# Altium schematic sheet Microcontroller.SchDoc
size A3; SheetNumber: 4; SheetTotal: 5
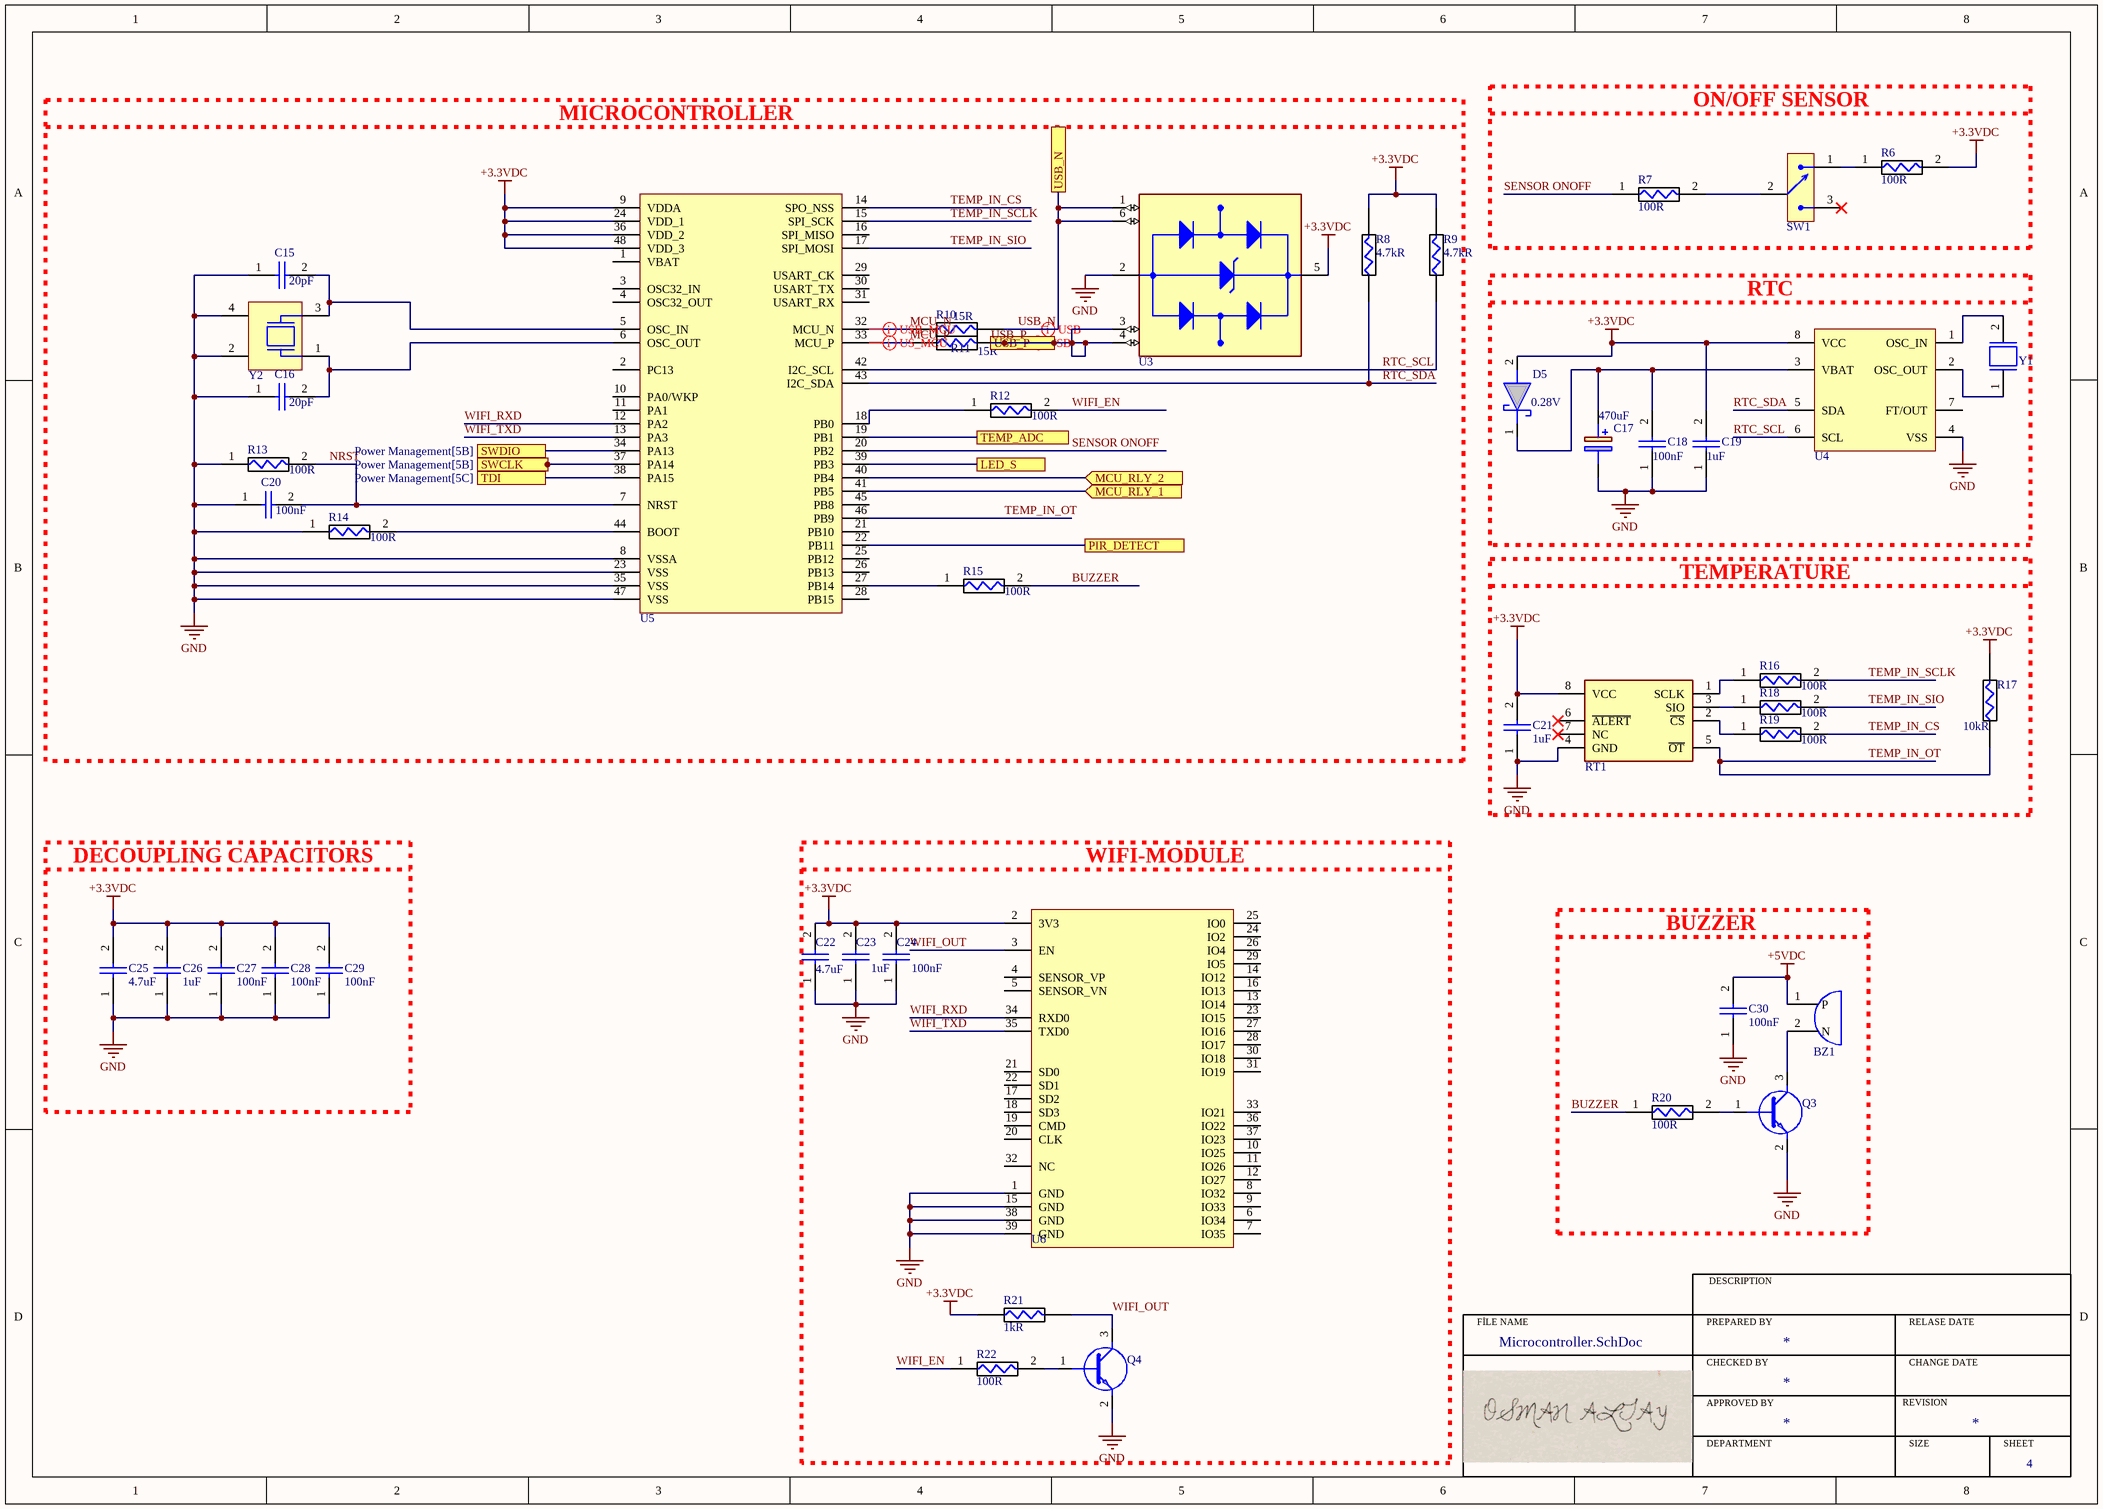
[diagram p0: Microcontroller.SchDoc]

## Parts
BZ1  CMI-9605IC-0580T  [CMI-9605IC-0580T]  (value not drawn)
C15  value 20pF  [CAP_0603]  (hidden comment: CL10C200JB8NNNC)
C16  value 20pF  [CAP_0603]  (hidden comment: CL10C200JB8NNNC)
C17  value 470uF  [ESH477M050AH4AA]  (hidden comment: ESH477M050AH4AA)
C18  value 100nF  [CAP_0805]  (hidden comment: CL21B104KBCNNNC)
C19  value 1uF  [CAP_0805]  (hidden comment: CL21B105KBFNNNE)
C20  value 100nF  [CAP_0603]  (hidden comment: C0603C104K1RACTU)
C21  value 1uF  [CAP_0805]  (hidden comment: CL21B105KBFNNNE)
C22  value 4.7uF  [CAP_0805]  (hidden comment: CL21A475KAQNNNE)
C23  value 1uF  [CAP_0805]  (hidden comment: CL21B105KBFNNNE)
C24  value 100nF  [CAP_0603]  (hidden comment: C0603C104K1RACTU)
C25  value 4.7uF  [CAP_0805]  (hidden comment: CL21A475KAQNNNE)
C26  value 1uF  [CAP_0805]  (hidden comment: CL21B105KBFNNNE)
C27  value 100nF  [CAP_0603]  (hidden comment: C0603C104K1RACTU)
C28  value 100nF  [CAP_0603]  (hidden comment: C0603C104K1RACTU)
C29  value 100nF  [CAP_0603]  (hidden comment: C0603C104K1RACTU)
C30  value 100nF  [CAP_0805]  (hidden comment: CL21B104KBCNNNC)
D5  Forward Voltage: 0.28V  [SOD882]  (hidden comment: RB521CS30L,315)
Q3  MMBT3904-7-F  [SOT23-3]  (value not drawn)
Q4  MMBT3904-7-F  [SOT23-3]  (value not drawn)
R6  value 100R  [RES_0603]  (hidden comment: RC0603FR-07100RL)
R7  value 100R  [RES_0603]  (hidden comment: RC0603FR-07100RL)
R8  value 4.7kR  [RES_0603]  (hidden comment: RC0603JR-074K7L)
R9  value 4.7kR  [RES_0603]  (hidden comment: RC0603JR-074K7L)
R10  value 15R  [RES_0603]  (hidden comment: RC0603JR-0715RL)
R11  value 15R  [RES_0603]  (hidden comment: RC0603JR-0715RL)
R12  value 100R  [RES_0603]  (hidden comment: RC0603FR-07100RL)
R13  value 100R  [RES_0603]  (hidden comment: RC0603FR-07100RL)
R14  value 100R  [RES_0603]  (hidden comment: RC0603FR-07100RL)
R15  value 100R  [RES_0603]  (hidden comment: RC0603FR-07100RL)
R16  value 100R  [RES_0603]  (hidden comment: RC0603FR-07100RL)
R17  value 10kR  [RES_0603]  (hidden comment: RC0603FR-0710KL)
R18  value 100R  [RES_0603]  (hidden comment: RC0603FR-07100RL)
R19  value 100R  [RES_0603]  (hidden comment: RC0603FR-07100RL)
R20  value 100R  [RES_0603]  (hidden comment: RC0603FR-07100RL)
R21  value 1kR  [RES_0603]  (hidden comment: RC0201JR-071KL)
R22  value 100R  [RES_0603]  (hidden comment: RC0603FR-07100RL)
RT1  MAX6662MSA+  [MAX6662MSA+]  (value not drawn)
SW1  EG1215AA  [SW_EG1215AA]  (value not drawn)
U3  USBLC6-2SC6  [SOT23-6]  (value not drawn)
U4  M41T00M6F  [M41T00]  (value not drawn)
U5  STM32F103C6T6A  [LQFP-48]  (value not drawn)
U6  ESP32-WROOM-32  [ESP32]  (value not drawn)
Y1  ABS05-32.768KHZ-T  [ABS05]  (value not drawn)
Y2  ECS-160-20-30B-TR  [ECS]  (value not drawn)

## Blocks framed on the sheet
MICROCONTROLLER: C15 C16 C20 R8-R15 U3 U5 Y2
ON/OFF SENSOR: R6 R7 SW1
TEMPERATURE: C21 R16-R19 RT1
DECOUPLING CAPACITORS: C25-C29
WIFI-MODULE: C22-C24 Q4 R21 R22 U6
BUZZER: BZ1 C30 Q3 R20

## Ports
LED_S (see Power Management[3C]), MCU_RLY_1 (in, see Power Management[4A]), MCU_RLY_2 (in, see Power Management[6A]), PIR_DETECT (see Power Management[3C]), SWCLK (see Power Management[5B]), SWDIO (see Power Management[5B]), TDI (see Power Management[5C]), TEMP_ADC (see Power Management[3C]), USB_N (see Power Management[8B]), USB_P (see Power Management[8B])

## Nets
+3.3VDC: C19.2 C21.2 C22.2 C23.2 C24.2 C25.2 C26.2 C27.2 C28.2 C29.2 D5.2(A) R6.2 R8.2 R9.2 R17.2 R21.1 RT1.8(VCC) U3.5(VBUS) U4.8(VCC) U5.9(VDDA) U5.24(VDD_1) U5.36(VDD_2) U5.48(VDD_3) U6.2(3V3)
+5VDC: BZ1.1(P) C30.2
GND: C15.1 C16.1 C17.2(-) C18.1 C19.1 C20.1 C21.1 C22.1 C23.1 C24.1 C25.1 C26.1 C27.1 C28.1 C29.1 C30.1 Q3.2(E) Q4.2(E) R13.1 R14.1 RT1.4(GND) U3.2(GND) U4.4(VSS) U5.8(VSSA) U5.23(VSS) U5.35(VSS) U5.47(VSS) U6.1(GND) U6.15(GND) U6.38(GND) U6.39(GND) Y2.2(GND) Y2.4(GND)
BUZZER: R15.2 R20.1
LED_S: U5.39(PB3) ; port LED_S
MCU_N: R10.1 U5.32(MCU_N)
MCU_P: R11.1 U5.33(MCU_P)
MCU_RLY_1: U5.41(PB5) ; port MCU_RLY_1
MCU_RLY_2: U5.40(PB4) ; port MCU_RLY_2
NRST: C20.2 R13.2 U5.7(NRST)
PIR_DETECT: U5.22(PB11) ; port PIR_DETECT
RTC_SCL: R9.1 U4.6(SCL) U5.42(I2C_SCL)
RTC_SDA: R8.1 U4.5(SDA) U5.43(I2C_SDA)
SENSOR ONOFF: R7.1 U5.20(PB2)
SWCLK: U5.37(PA14) ; port SWCLK
SWDIO: U5.34(PA13) ; port SWDIO
TDI: U5.38(PA15) ; port TDI
TEMP_ADC: U5.19(PB1) ; port TEMP_ADC
TEMP_IN_CS: R19.2 U5.14(SPO_NSS)
TEMP_IN_OT: R17.1 RT1.5(~{OT}) U5.46(PB9)
TEMP_IN_SCLK: R16.2 U5.15(SPI_SCK)
TEMP_IN_SIO: R18.2 U5.17(SPI_MOSI)
USB_N: R10.2 U3.1(I/O1_IN) U3.6(I/O1_OUT) ; port USB_N
USB_P: R11.2 U3.3(I/O2_IN) U3.4(I/O2_OUT) ; port USB_P
WIFI_EN: R12.2 R22.1
WIFI_OUT: Q4.3(C) R21.2 U6.3(EN)
WIFI_RXD: U5.12(PA2) U6.34(RXD0)
WIFI_TXD: U5.13(PA3) U6.35(TXD0)
NetBZ1_2: BZ1.2(N) Q3.3(C)
NetC15_2: C15.2 U5.5(OSC_IN) Y2.3(OUT/IN)
NetC16_2: C16.2 U5.6(OSC_OUT) Y2.1(IN/OUT)
NetC17_1: C17.1(+) C18.2 D5.1(K) U4.3(VBAT)
NetQ3_1: Q3.1(B) R20.2
NetQ4_1: Q4.1(B) R22.2
NetR6_1: R6.1 SW1.1
NetR7_2: R7.2 SW1.2
NetR12_1: R12.1 U5.18(PB0)
NetR14_2: R14.2 U5.44(BOOT)
NetR15_1: R15.1 U5.27(PB14)
NetR16_1: R16.1 RT1.1(SCLK)
NetR18_1: R18.1 RT1.3(SIO)
NetR19_1: R19.1 RT1.2(~{CS})
NetU4_1: U4.1(OSC_IN) Y1.2
NetU4_2: U4.2(OSC_OUT) Y1.1

Not connected (* = marked no-connect by the designer): RT1 6(~{ALERT})* 7(NC)*; SW1 3*; U4 7(FT/OUT); U5 1(VBAT) 2(PC13) 3(OSC32_IN) 4(OSC32_OUT) 10(PA0/WKP) 11(PA1) 16(SPI_MISO) 21(PB10) 25(PB12) 26(PB13) 28(PB15) 29(USART_CK) 30(USART_TX) 31(USART_RX) 45(PB8); U6 4(SENSOR_VP) 5(SENSOR_VN) 6(IO34) 7(IO35) 8(IO32) 9(IO33) 10(IO25) 11(IO26) 12(IO27) 13(IO14) 14(IO12) 16(IO13) 17(SD2) 18(SD3) 19(CMD) 20(CLK) 21(SD0) 22(SD1) 23(IO15) 24(IO2) 25(IO0) 26(IO4) 27(IO16) 28(IO17) 29(IO5) 30(IO18) 31(IO19) 32(NC) 33(IO21) 36(IO22) 37(IO23)

## Layout directives
differential pair: MCU_N, MCU_P, USB_N, USB_P

## Notes on the sheet
- RTC
- FİLE NAME
- PREPARED BY
- DESCRIPTION
- RELASE DATE
- CHECKED BY
- APPROVED BY
- CHANGE DATE
- DEPARTMENT
- SIZE
- REVISION
- SHEET

## Library data of the parts
BZ1 = CMI-9605IC-0580T: Audio Buzzer Magnetic 3VDC 7VDC 30mA 5VDC 85dB 2600Hz to 2800Hz Through Hole Pin Box; Manufacturer: CUI Devices; Supplier: Mouser; Supplier Part Number: 490-CMI-9605IC-0580T; Manufacturer Part Number: CMI-9605IC-0580T; RoHS: No; Category: Audio Products; Stock: 1177; Pricing: 1=1,42, 10=1,19, 50=1,04, 100=0,975, 1000=0,838, 10000=0,768 (USD)
C15 C16 = CAP CER 20pF 0603: CAP CER 20pF %5 0603; Manufacturer: Samsung; Voltage Rating (DC): 50V; Designed By: Osman; Supplier: Farnell; Supplier Part Number: 3013444RL; Manufacturer Part Number: CL10C200JB8NNNC; RoHS: Yes; Category: Ceramic Capacitors; Stock: 220; Pricing: 500=0,013, 1000=0,011, 2000=0,0108 (EUR); ComponentLink1URL: https://datasheet.ciiva.com/26877/getdatasheetpartid-640634-26877974.pdf?src-supplier=Verical; ComponentLink1Description: https://datasheet.ciiva.com/26877/getdatasheetpartid-640634-26877974.pdf?src-supplier=Verical; ComponentLink2URL: https://datasheet.ciiva.com/26310/mlcc-catalogdownload2013-eng-26310315.pdf?src-supplier=Distrelec; ComponentLink2Description: https://datasheet.ciiva.com/26310/mlcc-catalogdownload2013-eng-26310315.pdf?src-supplier=Distrelec
C17 = CAP ALU 470uF: Cap, 470UF, 50V, Alu Elec, Radial; Manufacturer: KEMET; Designed By: Osman; Supplier: Mouser; Supplier Part Number: 80-ESH477M050AH4AA; Manufacturer Part Number: ESH477M050AH4AA; RoHS: Yes; Stock: 9408; Pricing: 1=0,57, 10=0,338, 50=0,338, 100=0,222, 1000=0,167, 10000=0,148 (USD); ComponentLink1URL: https://api.kemet.com/component-edge/download/datasheet/ESH477M050AH4AA.pdf?src-supplier=Digi-Key; ComponentLink1Description: https://api.kemet.com/component-edge/download/datasheet/ESH477M050AH4AA.pdf?src-supplier=Digi-Key; ComponentLink2URL: https://datasheet.octopart.com/ESH477M050AH4AA-KEMET-datasheet-130075338.pdf?src-supplier=Newark; ComponentLink2Description: https://datasheet.octopart.com/ESH477M050AH4AA-KEMET-datasheet-130075338.pdf?src-supplier=Newark
C18 C30 = CAP CER 100nF 0805: Manufacturer: Samsung; Material: Ceramic; Tolerance: 10%; Dielectric: X7R; Voltage Rating: 50V; Designed By: OSMAN; Supplier: Mouser; Supplier Part Number: 187-CL21B104KBCNNNC; Manufacturer Part Number: CL21B104KBCNNNC; RoHS: Yes; Category: Ceramic Capacitors; Stock: 995893; Pricing: 1=0,1, 10=0,024, 50=0,024, 100=0,014, 1000=0,012, 10000=0,008 (USD); Mounting Technology: Surface Mount; Case/Package: 0805; Case Code (Metric): 2012; Case Code (Imperial): 0805; Min Operating Temperature: -55°C; Max Operating Temperature: 125°C; Packaging: Tape and Reel; Voltage: 50V; Series: CL; Construction: Flat; Voltage Rating (DC): 50V; Length: 2mm; Width: 0.049inch; Height: 0.85mm; Depth: 1.25mm; Thickness: 0.037inch; Radiation Hardening: No; RoHS Compliant: Yes; Lead Free: 5697LeadFree; ComponentLink1URL: https://datasheet.ciiva.com/25710/cl21b104kbcnnnc-25710182.pdf?src-supplier=Digi-Key; ComponentLink1Description: https://datasheet.ciiva.com/25710/cl21b104kbcnnnc-25710182.pdf?src-supplier=Digi-Key; ComponentLink2URL: https://datasheet.ciiva.com/29199/454152-da-01-en-vs-kondensator-0805-29199814.pdf?src-supplier=Conrad; ComponentLink2Description: https://datasheet.ciiva.com/29199/454152-da-01-en-vs-kondensator-0805-29199814.pdf?src-supplier=Conrad
C19 C21 C23 C26 = CAP CER 1uF 0805: CAP CER 1uF %10 0805; Manufacturer: Samsung; Material: Ceramic; Tolerance: 10%; Voltage Rating: 50V; Dielectric: X7R; Designed By: Osman; Supplier: Mouser; Supplier Part Number: 187-CL21B105KBFNNNE; Manufacturer Part Number: CL21B105KBFNNNE; RoHS: Yes; Category: Ceramic Capacitors; Stock: 126210; Pricing: 1=0,11, 10=0,045, 50=0,045, 100=0,027, 1000=0,026, 10000=0,015 (USD); Mounting Technology: Surface Mount; Case/Package: 0805; Case Code (Metric): 2012; Case Code (Imperial): 0805; Min Operating Temperature: -55°C; Max Operating Temperature: 125°C; Packaging: Tape and Reel; Package Quantity: 1; Voltage: 50V; Series: CL; Construction: Flat; Voltage Rating (DC): 50V; Length: 2mm; Width: 0.049inch; Height: 1.25mm; Thickness: 0.053inch; Depth: 1.25mm; Radiation Hardening: No; RoHS Compliant: Yes; ComponentLink1URL: https://datasheet.ciiva.com/25800/cl21b105kbfnnne-25800291.pdf?src-supplier=Digi-Key; ComponentLink1Description: https://datasheet.ciiva.com/25800/cl21b105kbfnnne-25800291.pdf?src-supplier=Digi-Key
C20 C24 C27-C29 = CAP CER 100nf 0603: Capacitor, 0.1UF, 100V, MLCC, 0603;; Manufacturer: KEMET; Designed By: Osman; Supplier: Digi-Key; Supplier Part Number: 399-C0603C104K1RACTUCT-ND; Manufacturer Part Number: C0603C104K1RACTU; RoHS: No; Category: Ceramic Capacitors; Stock: 5862; Pricing: 1=0,27, 10=0,185, 50=0,1232, 100=0,1048, 500=0,07396, 1000=0,06471 (USD)
C22 C25 = CAP CER 4.7uF 0805: CAP CER 4.7uF %10 0805; Manufacturer: Samsung; Material: Ceramic; Tolerance: 10%; Voltage Rating: 25V; Dielectric: X5R; Supplier Part Number: 187-CL21A475KAQNNNE; Manufacturer Part Number: CL21A475KAQNNNE; RoHS: Yes; Category: Ceramic Capacitors; Stock: 195468; Pricing: 1=0,1, 10=0,059, 50=0,059, 100=0,035, 1000=0,025, 10000=0,012 (USD); Mounting Technology: Surface Mount; Case/Package: 0805; Case Code (Metric): 2012; Case Code (Imperial): 0805; Min Operating Temperature: -55°C; Max Operating Temperature: 85°C; Packaging: Tape and Reel; Voltage Rating (DC): 25V; Series: CL; Construction: Flat; Length: 2mm; Height: 1.25mm; Depth: 1.25mm; Radiation Hardening: No; Lead Free: Lead Free; RoHS Compliant: Yes; ComponentLink1URL: https://datasheet.ciiva.com/25798/cl21a475kaqnnne-25798882.pdf?src-supplier=Digi-Key; ComponentLink1Description: https://datasheet.ciiva.com/25798/cl21a475kaqnnne-25798882.pdf?src-supplier=Digi-Key; Supplier: Mouser
D5 = RB521CS30L,315: 100MA Low Vf Mega Schottky Barri; Manufacturer: Nexperia; Manufacturer Part Number: RB521CS30L315; Supplier: Mouser; Supplier Part Number: 771-RB521CS30L315; RoHS: No; Category: Rectifier Diodes; Stock: 268555; Pricing: 1=0,23, 10=0,167, 50=0,167, 100=0,098, 1000=0,049, 10000=0,032 (USD); ComponentLink1URL: https://datasheet.octopart.com/RB521CS30L%2C315-Nexperia-datasheet-87845498.pdf?src-supplier=Future+Electronics; ComponentLink1Description: https://datasheet.octopart.com/RB521CS30L%2C315-Nexperia-datasheet-87845498.pdf?src-supplier=Future+Electronics
Q3 Q4 = MMBT3904-7-F: Transistor General Purpose BJT NPN 40 Volt 0.2A Automotive 3-Pin SOT-23; Manufacturer: Diodes Zetex; Designed By: Osman; Max Power Dissipation: 300mW; Collector Emitter Voltage (VCEO): 40V; Max Collector Current: 200mA; Collector Base Voltage (VCBO): 60V; Power Dissipation: 350mW; Frequency: 300MHz; hFE Min: 100; Number of Elements: 1; Emitter Base Voltage (VEBO): 6V; Collector Emitter Saturation Voltage: 300mV; Supplier: Mouser; Supplier Part Number: 621-MMBT3904-F; Manufacturer Part Number: MMBT3904-7-F; RoHS: Yes; Category: BJTs; Stock: 3104650; Pricing: 1=0,11, 10=0,076, 50=0,076, 100=0,048, 1000=0,021, 10000=0,014 (USD); Mounting Technology: Surface Mount; Case/Package: SOT-23; Pins: 3; Weight: 0.000282oz; Min Operating Temperature: -55°C; Max Operating Temperature: 150°C; Polarity: NPN; Packaging: Tape and Reel; Package Quantity: 3000; Transition Frequency: 300MHz; Collector Emitter Breakdown Voltage: 40V; Max Breakdown Voltage: 40V; Continuous Collector Current: 200mA; Clock Frequency: 300MHz; Gain Bandwidth Product: 300MHz; Voltage Rating (DC): 40V; Series: Automotive, AEC-Q101; Collector-emitter Voltage-Max: 300mV; Length: 3.05mm; Width: 1.4mm; Height: 1mm; Radiation Hardening: No; Reach SVHC Compliant: No; Lead Free: Lead Free; RoHS Compliant: Yes; ComponentLink1URL: https://datasheet.ciiva.com/11201/ds30036-11201778.pdf?src-supplier=Avnet; ComponentLink1Description: https://datasheet.ciiva.com/11201/ds30036-11201778.pdf?src-supplier=Avnet; ComponentLink2URL: https://datasheet.ciiva.com/15138/getdatasheetpartid-53265-15138780.pdf?src-supplier=Verical; ComponentLink2Description: https://datasheet.ciiva.com/15138/getdatasheetpartid-53265-15138780.pdf?src-supplier=Verical; ComponentLink3URL: https://datasheet.ciiva.com/22711/1915516-22711750.pdf?src-supplier=Element14; ComponentLink3Description: https://datasheet.ciiva.com/22711/1915516-22711750.pdf?src-supplier=Element14; ComponentLink4URL: https://datasheet.ciiva.com/11198/ds30036-11198999.pdf?src-supplier=Avnet; ComponentLink4Description: https://datasheet.ciiva.com/11198/ds30036-11198999.pdf?src-supplier=Avnet; ComponentLink5URL: https://datasheet.ciiva.com/6361/ds30036-6361256.pdf?src-supplier=Digi-Key; ComponentLink5Description: https://datasheet.ciiva.com/6361/ds30036-6361256.pdf?src-supplier=Digi-Key; ComponentLink6URL: https://datasheet.ciiva.com/6361/ds30036-6361254.pdf?src-supplier=Digi-Key; ComponentLink6Description: https://datasheet.ciiva.com/6361/ds30036-6361254.pdf?src-supplier=Digi-Key
R6 R7 R12-R16 R18-R20 R22 = RES 100 OHM 0603: SMD Chip Resistor, 100 Ohm, ± 1%, 100 mW, 0603 [1608 Metric], Thick Film, General Purpose; Manufacturer: Yageo; Temperature Coefficient: 100ppm/°C; Voltage Rating (DC): 50V; Power Rating: 100mW; Supplier: Digi-Key; Supplier Part Number: 311-100HRTR-ND; Manufacturer Part Number: RC0603FR-07100RL; RoHS: Yes; Category: Chip SMD Resistors; Stock: 2448697; Pricing: 5000=0,00382, 10000=0,00335, 25000=0,00287, 35000=0,00278, 50000=0,00257, 125000=0,00232 (USD); Case/Package: 0603; Pins: 2; Case Code (Imperial): 0603; Case Code (Metric): 1608; Min Operating Temperature: -55°C; Max Operating Temperature: 155°C; Tolerance: 1%; Resistor Type: Thick Film; Packaging: Tape and Reel; Voltage Rating: 50V; Termination: SMD/SMT; Features: Moisture Resistant; Series: RC; Max Power Dissipation: 100mW; Number of Terminations: 2; Construction: Rectangular; Resistance Tolerance: 1%; Technology: THICK FILM; Length: 1.6mm; Width: 0.8mm; Height: 0.45mm; Depth: 0.8mm; Lead Free: Lead Free; RoHS Compliant: Yes; Reach SVHC Compliant: Unknown; Military Standard: Not
R8 R9 = RES 4K7 OHM 0603: SMD Chip Resistor, 4.7 kOhm, ± 5%, 100 mW, 0603 [1608 Metric], Thick Film, General Purpose; Manufacturer: Yageo; Voltage Rating (DC): 50V; Temperature Coefficient: 100ppm/°C; Power Rating: 100mW; Supplier: Mouser; Supplier Part Number: 603-RC0603JR-074K7L; Manufacturer Part Number: RC0603JR-074K7L; RoHS: Yes; Category: Chip SMD Resistors; Stock: 1439844; Pricing: 1=0,1, 10=0,009, 50=0,009, 100=0,005, 1000=0,005, 10000=0,002 (USD); Case/Package: 0603; Pins: 2; Case Code (Imperial): 0603; Case Code (Metric): 1608; Min Operating Temperature: -55°C; Max Operating Temperature: 155°C; Resistor Type: Thick Film; Tolerance: 5%; Packaging: Tape and Reel; Voltage Rating: 50V; Termination: SMD/SMT; Features: Moisture Resistant; Max Power Dissipation: 100mW; Number of Terminations: 2; Series: RC; Resistance Tolerance: 5%; Construction: Rectangular; Voltage Rating (AC): 50V; Length: 1.6mm; Width: 0.8mm; Depth: 0.8mm; Reach SVHC Compliant: No; RoHS Compliant: Yes; Lead Free: 5697LeadFree; Military Standard: Not; ComponentLink1URL: https://datasheet.ciiva.com/46412/443971-46412858.pdf?src-supplier=Element14; ComponentLink1Description: https://datasheet.ciiva.com/46412/443971-46412858.pdf?src-supplier=Element14
R10 R11 = RES 15 OHM 0603: SMD Chip Resistor, 15 Ohm, ± 5%, 100 mW, 0603 [1608 Metric], Thick Film, General Purpose; Manufacturer: Yageo; Voltage Rating (AC): 50V; Supplier: Farnell; Supplier Part Number: 4151593; Manufacturer Part Number: RC0603JR-0715RL; RoHS: Yes; Category: Chip SMD Resistors; Stock: 5000; Pricing: 5000=0,002, 25000=0,0019, 50000=0,0018 (EUR); ComponentLink1URL: https://datasheet.ciiva.com/2453/pyu-r-int-thick-7-2453085.pdf?src-supplier=Digi-Key; ComponentLink1Description: https://datasheet.ciiva.com/2453/pyu-r-int-thick-7-2453085.pdf?src-supplier=Digi-Key; ComponentLink2URL: https://datasheet.ciiva.com/2453/pyu-r-int-thick-7-2453086.pdf?src-supplier=Digi-Key; ComponentLink2Description: https://datasheet.ciiva.com/2453/pyu-r-int-thick-7-2453086.pdf?src-supplier=Digi-Key; ComponentLink3URL: https://datasheet.ciiva.com/2453/pyu-r-int-thick-7-2453087.pdf?src-supplier=Digi-Key; ComponentLink3Description: https://datasheet.ciiva.com/2453/pyu-r-int-thick-7-2453087.pdf?src-supplier=Digi-Key; ComponentLink4URL: https://datasheet.ciiva.com/7746/443971-7746445.pdf?src-supplier=Element14; ComponentLink4Description: https://datasheet.ciiva.com/7746/443971-7746445.pdf?src-supplier=Element14; ComponentLink5URL: https://datasheet.ciiva.com/7746/443971-7746446.pdf?src-supplier=Element14; ComponentLink5Description: https://datasheet.ciiva.com/7746/443971-7746446.pdf?src-supplier=Element14
R17 = RES 10K Ohm 0603: RES 10K OHM %10 0603; Manufacturer: Yageo; Tolerance: 1%; Temperature Coefficient: 100ppm/°C; Voltage Rating (DC): 50V; Power Rating: 100mW; Voltage Rating: 75V; Designed Ny: Osman; Supplier: Digi-Key; Supplier Part Number: 311-10.0KHRDKR-ND; Manufacturer Part Number: RC0603FR-0710KL; RoHS: Yes; Category: Chip SMD Resistors; Stock: 22481256; Pricing: 1=0,1, 10=0,018, 50=0,0106, 100=0,0088, 500=0,00592, 1000=0,00505 (USD); Case/Package: 0603; Pins: 2; Case Code (Imperial): 0603; Case Code (Metric): 1608; Weight: 7.1E-05oz; Min Operating Temperature: -55°C; Max Operating Temperature: 155°C; Resistor Type: Thick Film; Packaging: Tape and Reel; Termination: SMD/SMT; Features: Moisture Resistant; Series: RC; Max Power Dissipation: 100mW; Number of Terminations: 2; Resistance Tolerance: 1%; Construction: Rectangular; Length: 1.6mm; Width: 0.8mm; Height: 0.45mm; Depth: 0.8mm; Lead Pitch: 0.3mm; Reach SVHC Compliant: No; Lead Free: 5697LeadFree; Military Standard: Not; RoHS Compliant: Yes; ComponentLink1URL: https://datasheet.ciiva.com/7660/38590-7660789.pdf?src-supplier=Element14; ComponentLink1Description: https://datasheet.ciiva.com/7660/38590-7660789.pdf?src-supplier=Element14; ComponentLink2URL: https://datasheet.ciiva.com/7983/443971-7983596.pdf?src-supplier=Element14; ComponentLink2Description: https://datasheet.ciiva.com/7983/443971-7983596.pdf?src-supplier=Element14; ComponentLink3URL: https://datasheet.ciiva.com/22747/443971-22747519.pdf?src-supplier=Element14; ComponentLink3Description: https://datasheet.ciiva.com/22747/443971-22747519.pdf?src-supplier=Element14; ComponentLink4URL: https://datasheet.ciiva.com/46440/1868787-46440891.pdf?src-supplier=Element14; ComponentLink4Description: https://datasheet.ciiva.com/46440/1868787-46440891.pdf?src-supplier=Element14; ComponentLink5URL: https://datasheet.ciiva.com/7746/1738695-7746239.pdf?src-supplier=Element14; ComponentLink5Description: https://datasheet.ciiva.com/7746/1738695-7746239.pdf?src-supplier=Element14; ComponentLink6URL: https://datasheet.ciiva.com/15189/getdatasheetpartid-409289-15189591.pdf?src-supplier=Verical; ComponentLink6Description: https://datasheet.ciiva.com/15189/getdatasheetpartid-409289-15189591.pdf?src-supplier=Verical
R21 = RES 1K OHM 0603: Res Thick Film 0201 1K Ohm 5% 0.05W(1/20W) ±200ppm/C Pad SMD T/R; Manufacturer: Yageo; Supplier: Digi-Key; Supplier Part Number: 311-1KNCT-ND; Manufacturer Part Number: RC0201JR-071KL; RoHS: Yes; Category: Chip SMD Resistors; Stock: 16512; Pricing: 1=0,1, 10=0,02, 50=0,0124, 100=0,0104, 500=0,0071, 1000=0,00612, 5000=0,00444 (USD); ComponentLink1URL: https://datasheet.ciiva.com/46391/1421516-46391293.pdf?src-supplier=Element14; ComponentLink1Description: https://datasheet.ciiva.com/46391/1421516-46391293.pdf?src-supplier=Element14; ComponentLink2URL: https://datasheet.ciiva.com/7660/1421516-7660811.pdf?src-supplier=Element14; ComponentLink2Description: https://datasheet.ciiva.com/7660/1421516-7660811.pdf?src-supplier=Element14; ComponentLink3URL: https://datasheet.ciiva.com/7672/1563626-7672264.pdf?src-supplier=Element14; ComponentLink3Description: https://datasheet.ciiva.com/7672/1563626-7672264.pdf?src-supplier=Element14; ComponentLink4URL: https://datasheet.ciiva.com/7672/1563626-7672265.pdf?src-supplier=Element14; ComponentLink4Description: https://datasheet.ciiva.com/7672/1563626-7672265.pdf?src-supplier=Element14; ComponentLink5URL: https://datasheet.ciiva.com/8896/pyu-rc0201-51-rohs-l-8-8896175.pdf?src-supplier=Avnet; ComponentLink5Description: https://datasheet.ciiva.com/8896/pyu-rc0201-51-rohs-l-8-8896175.pdf?src-supplier=Avnet; ComponentLink6URL: https://datasheet.ciiva.com/2462/pyu-r-int-thick-7-2462829.pdf?src-supplier=Digi-Key; ComponentLink6Description: https://datasheet.ciiva.com/2462/pyu-r-int-thick-7-2462829.pdf?src-supplier=Digi-Key; ComponentLink7URL: https://datasheet.ciiva.com/2462/pyu-r-int-thick-7-2462830.pdf?src-supplier=Digi-Key; ComponentLink7Description: https://datasheet.ciiva.com/2462/pyu-r-int-thick-7-2462830.pdf?src-supplier=Digi-Key; ComponentLink8URL: https://datasheet.ciiva.com/2462/pyu-r-int-thick-7-2462831.pdf?src-supplier=Digi-Key; ComponentLink8Description: https://datasheet.ciiva.com/2462/pyu-r-int-thick-7-2462831.pdf?src-supplier=Digi-Key
RT1 = MAX6662MSA+: Temp Sensor Digital Serial (3-Wire, SPI) 8-Pin SOIC N Tube; Manufacturer: Maxim; Designed By: Osman; Supplier: Mouser; Supplier Part Number: 700-MAX6662MSA; Manufacturer Part Number: MAX6662MSA+; RoHS: Yes; Category: Temperature and Humidity Sensors; Stock: 1124; Pricing: 1=4,6, 10=3,45, 50=3,45, 100=2,81, 1000=2,2, 10000=2,12 (USD); ComponentLink1URL: https://datasheet.ciiva.com/5299/max6662-89142-5299456.pdf?src-supplier=Mouser; ComponentLink1Description: https://datasheet.ciiva.com/5299/max6662-89142-5299456.pdf?src-supplier=Mouser; ComponentLink2URL: https://datasheet.ciiva.com/2003/max6662-2003390.pdf?src-supplier=Digi-Key; ComponentLink2Description: https://datasheet.ciiva.com/2003/max6662-2003390.pdf?src-supplier=Digi-Key; ComponentLink3URL: https://datasheet.ciiva.com/3277/max6662-3277979.pdf?src-supplier=Avnet; ComponentLink3Description: https://datasheet.ciiva.com/3277/max6662-3277979.pdf?src-supplier=Avnet
SW1 = EG1215AA: Slide Switch, SPDT, 0.025A, 24V, SMD; Manufacturer: E-Switch; Mechanical Life: 10000Cycles; Switch Function: On-On; Actuator Type: Standard; Switch Travel: 1.5mm; Operating Force: 150gf; Actuator Length: 1.4mm; Desgined By: Osman; Supplier: Digi-Key; Supplier Part Number: EG5720CT-ND; Manufacturer Part Number: EG1215AA; RoHS: Yes; Stock: 17551; Pricing: 1=0,99, 10=0,951, 25=0,8884, 100=0,7715, 250=0,702, 500=0,6508, 1000=0,60327 (USD); Mounting Technology: Surface Mount; Min Operating Temperature: -20°C; Max Operating Temperature: 70°C; Throw Configuration: SPDT; Packaging: Cut Tape; Voltage Rating (DC): 24V; Termination: Gull Wing; Electrical Life: 10000Cycles; Series: EG; RoHS Compliant: Yes; ComponentLink1URL: https://media.digikey.com/pdf/Data%20Sheets/E-Switch%20PDFs/EG1215_Series_Ds.pdf?src-supplier=Digi-Key; ComponentLink1Description: https://media.digikey.com/pdf/Data%20Sheets/E-Switch%20PDFs/EG1215_Series_Ds.pdf?src-supplier=Digi-Key; ComponentLink2URL: http://www.farnell.com/datasheets/2645007.pdf?src-supplier=Farnell; ComponentLink2Description: http://www.farnell.com/datasheets/2645007.pdf?src-supplier=Farnell
U3 = USBLC6-2SC6: USBLC6 Series 2 Line 6 V Uni / Bi-Directional ESD Protection - SOT-23-6; Manufacturer: STMicroelectronics; Direction: Unidirectional,Bidirectional; Value: 3.5pF; Operating Supply Voltage: 1.1V; Number of Channels: 2; Breakdown Voltage: 6V; Clamping Voltage: 17V; Reverse Standoff Voltage: 5.25V; Power Line Protection: Yes; Test Current: 1mA; Max Reverse Leakage Current: 150nA; Peak Pulse Current: 5A; Data Rate: 480Mbps; Number of Elements: 1; Working Voltage: 5V; Supplier: Farnell; Supplier Part Number: 2473979; Manufacturer Part Number: USBLC6-2SC6; RoHS: Yes; Category: TVS Diodes; Stock: 198000; Pricing: 3000=0,202, 9000=0,176, 24000=0,168, 45000=0,165 (EUR); Mounting Technology: Surface Mount; Case/Package: SOT-23; Pins: 6; Min Operating Temperature: -40°C; Max Operating Temperature: 125°C; Packaging: Tape and Reel; Package Quantity: 3000; Termination: SMD/SMT; Number of Bidirectional Channels: 2; Min Breakdown Voltage: 6V; ESD Protection: Yes; Leakage Current: 150nA; Series: USB; Reverse Breakdown Voltage: 6V; Polarity: Unidirectional,Bidirectional; Max Breakdown Voltage: 6V; Clamping Voltage-Max: 17V; Length: 3.05mm; Width: 1.75mm; Height: 1.3mm; Depth: 1.75mm; Radiation Hardening: No; Reach SVHC Compliant: No; Lead Free: Lead Free; RoHS Compliant: Yes; ComponentLink1URL: https://datasheet.ciiva.com/1268/1690354-1268384.pdf?src-supplier=Element14; ComponentLink1Description: https://datasheet.ciiva.com/1268/1690354-1268384.pdf?src-supplier=Element14; ComponentLink2URL: https://datasheet.ciiva.com/4508/cd00050750-113117-4508433.pdf?src-supplier=Mouser; ComponentLink2Description: https://datasheet.ciiva.com/4508/cd00050750-113117-4508433.pdf?src-supplier=Mouser; ComponentLink3URL: https://datasheet.ciiva.com/15143/getdatasheetpartid-148465-15143789.pdf?src-supplier=Verical; ComponentLink3Description: https://datasheet.ciiva.com/15143/getdatasheetpartid-148465-15143789.pdf?src-supplier=Verical; ComponentLink4URL: https://datasheet.ciiva.com/16200/cd00050750-16200026.pdf?src-supplier=Future+Electronics; ComponentLink4Description: https://datasheet.ciiva.com/16200/cd00050750-16200026.pdf?src-supplier=Future+Electronics; ComponentLink5URL: https://datasheet.ciiva.com/41444/001184109-da-01-en-ic-esd-protecti-usblc6-2sc6-sot-23-6-stm-41444156.pdf?src-supplier=Conrad; ComponentLink5Description: https://datasheet.ciiva.com/41444/001184109-da-01-en-ic-esd-protecti-usblc6-2sc6-sot-23-6-stm-41444156.pdf?src-supplier=Conrad
U4 = M41T00: Real-time Clocks Clock/Calendar I2C, 2-Wire Serial 70uA @ 2V ~ 5.5V SOIC-8_150mil RoHS; Manufacturer: STMicroelectronics; Supplier: Digi-Key; Supplier Part Number: 497-4697-6-ND; Manufacturer Part Number: M41T00M6F; RoHS: Yes; Category: Real Time Clocks; Stock: 1800; Pricing: 1=3,77, 10=3,388, 25=3,2032, 100=2,776, 250=2,63364, 500=2,36316, 1000=1,99303 (USD); ComponentLink1URL: https://datasheet.ciiva.com/7630/1837112-7630077.pdf?src-supplier=Element14; ComponentLink1Description: https://datasheet.ciiva.com/7630/1837112-7630077.pdf?src-supplier=Element14; ComponentLink2URL: https://datasheet.ciiva.com/16213/cd00001542-16213654.pdf?src-supplier=Future+Electronics; ComponentLink2Description: https://datasheet.ciiva.com/16213/cd00001542-16213654.pdf?src-supplier=Future+Electronics; ComponentLink3URL: https://datasheet.ciiva.com/41459/001185345-da-01-en-ic-rtc-srl-512kbit-m41t00m6f-soic-8-stm-41459818.pdf?src-supplier=Conrad; ComponentLink3Description: https://datasheet.ciiva.com/41459/001185345-da-01-en-ic-rtc-srl-512kbit-m41t00m6f-soic-8-stm-41459818.pdf?src-supplier=Conrad; Min supply Voltage: 2V
U5 = STM32F103C6T6A: MCU 32-bit STM32F ARM Cortex M3 RISC 32KB Flash 2.5V/3.3V 48-Pin LQFP Tray; Manufacturer: STMicroelectronics; Number of Timers/Counters: 3; Max Supply Voltage: 3.6V; Interface: I2C,SPI,USART; RAM Size: 10KB; Number of I/Os: 37; Min Supply Voltage: 2V; Data Bus Width: 32b; Clock Frequency: 72MHz; Number of ADC Channels: 10; SLEEP MODE: EXİST; Designey by: OSMAN; Supply Voltage: 5.5v; Supplier: Digi-Key; Manufacturer Part Number: STM32F103C6T6A; RoHS: Yes; Category: Microcontrollers; Stock: 188; Pricing: 1=6,37, 10=5,723, 25=5,4104, 80=4,689, 250=4,44852, 500=3,99166, 1000=3,36645, 2500=3,19813 (USD); Case/Package: LQFP; Pins: 48; Weight: 0.006409oz; Min Operating Temperature: -40°C; Max Operating Temperature: 85°C; Packaging: Tray; Series: STM32F103C6; Package Quantity: 1500; Memory Format: FLASH; Memory Size: 32KB; Core Architecture: ARM; Length: 7mm; Width: 7mm; Height: 1.4mm; Lead Free: Lead Free; RoHS Compliant: Yes; ComponentLink1URL: https://datasheet.ciiva.com/15122/getdatasheetpartid-69879-15122075.pdf?src-supplier=Verical; ComponentLink1Description: https://datasheet.ciiva.com/15122/getdatasheetpartid-69879-15122075.pdf?src-supplier=Verical; ComponentLink2URL: https://datasheet.ciiva.com/14100/pustm-arm-microcont-stm32f103-en-14100507.pdf?src-supplier=Distrelec; ComponentLink2Description: https://datasheet.ciiva.com/14100/pustm-arm-microcont-stm32f103-en-14100507.pdf?src-supplier=Distrelec; NAME: STM32F103C6T6A; Supplier Part Number: 497-11515-ND
U6 = ESP32-WROOM-32: SMD module, ESP32-D0WD-V3, ESP32 ECO V3, 4 MB SPI flash, PCB antenna; Manufacturer: Espressif Systems; Manufacturer Part Number: ESP32-WROOM-32E(M113EH3200PH3Q0); Designed ny: Osman; Supplier: Digi-Key; Supplier Part Number: 1965-ESP32-WROOM-32E-N4TR-ND; RoHS: No; Category: RF Receivers, Transceivers; Pricing: 650=2,5 (USD)
Y1 = Crystal 32768KHz: CRYSTAL 32.768kHz ±20ppm Crystal 12.5pF 90 kOhm -40°C ^ 85°C Surface Mount 2-SMD; Manufacturer: Abracon; ESR (Equivalent Series Resistance): 90kR; Supplier: Mouser; Supplier Part Number: 815-ABS05-32.768K-T; Manufacturer Part Number: ABS05-32.768KHZ-T; RoHS: Yes; Category: Crystals; Stock: 113769; Pricing: 1=0,69, 10=0,525, 50=0,525, 100=0,479, 1000=0,414, 10000=0,343 (USD); Mounting Technology: Surface Mount; Case/Package: CSMD; Pins: 2; Min Operating Temperature: -40°C; Max Operating Temperature: 85°C; Packaging: Tape and Reel; Frequency Tolerance: 20ppm; Load Capacitance: 12.5pF; Package Quantity: 3000; Frequency: 32.768kHz; Tolerance: 20ppm; Termination: SMD/SMT; ESR: 90kR; Series: ABS05; Operating Frequency: 32.768 kHz; Length: 1.6mm; Width: 1mm; Height: 0.5mm; Depth: 1mm; Radiation Hardening: No; Reach SVHC Compliant: No; Lead Free: Lead Free; RoHS Compliant: Yes; ComponentLink1URL: https://datasheet.ciiva.com/23810/abs05-23810480.pdf?src-supplier=Newark; ComponentLink1Description: https://datasheet.ciiva.com/23810/abs05-23810480.pdf?src-supplier=Newark; ComponentLink2URL: https://datasheet.ciiva.com/6728/abs05-6728949.pdf?src-supplier=Digi-Key; ComponentLink2Description: https://datasheet.ciiva.com/6728/abs05-6728949.pdf?src-supplier=Digi-Key; ComponentLink3URL: https://datasheet.ciiva.com/6728/abs05-6728950.pdf?src-supplier=Digi-Key; ComponentLink3Description: https://datasheet.ciiva.com/6728/abs05-6728950.pdf?src-supplier=Digi-Key; ComponentLink4URL: https://datasheet.ciiva.com/16411/abs05-16411149.pdf?src-supplier=Future+Electronics; ComponentLink4Description: https://datasheet.ciiva.com/16411/abs05-16411149.pdf?src-supplier=Future+Electronics
Y2 = Crystal 16MHz: Crystal 16MHz ±30ppm (Tol) ±50ppm (Stability) 20pF FUND 50Ohm 4-Pin Mini-SMD T/R; Manufacturer: ECS International; Supplier: Digi-Key; Supplier Part Number: XC1120CT-ND; Manufacturer Part Number: ECS-160-20-30B-TR; RoHS: Yes; Category: Crystals; Stock: 27597; Pricing: 1=0,75, 10=0,628, 50=0,5648, 100=0,5021, 500=0,47702 (USD); ComponentLink1URL: https://datasheet.ciiva.com/853/ecx-53b-853408.pdf?src-supplier=Digi-Key; ComponentLink1Description: https://datasheet.ciiva.com/853/ecx-53b-853408.pdf?src-supplier=Digi-Key; ComponentLink2URL: https://datasheet.ciiva.com/853/ecx-53b-853407.pdf?src-supplier=Digi-Key; ComponentLink2Description: https://datasheet.ciiva.com/853/ecx-53b-853407.pdf?src-supplier=Digi-Key; ComponentLink3URL: https://datasheet.ciiva.com/853/ecx-53b-853406.pdf?src-supplier=Digi-Key; ComponentLink3Description: https://datasheet.ciiva.com/853/ecx-53b-853406.pdf?src-supplier=Digi-Key